# Altium schematic sheet FPGA.schdoc
size 240 x 209 mm
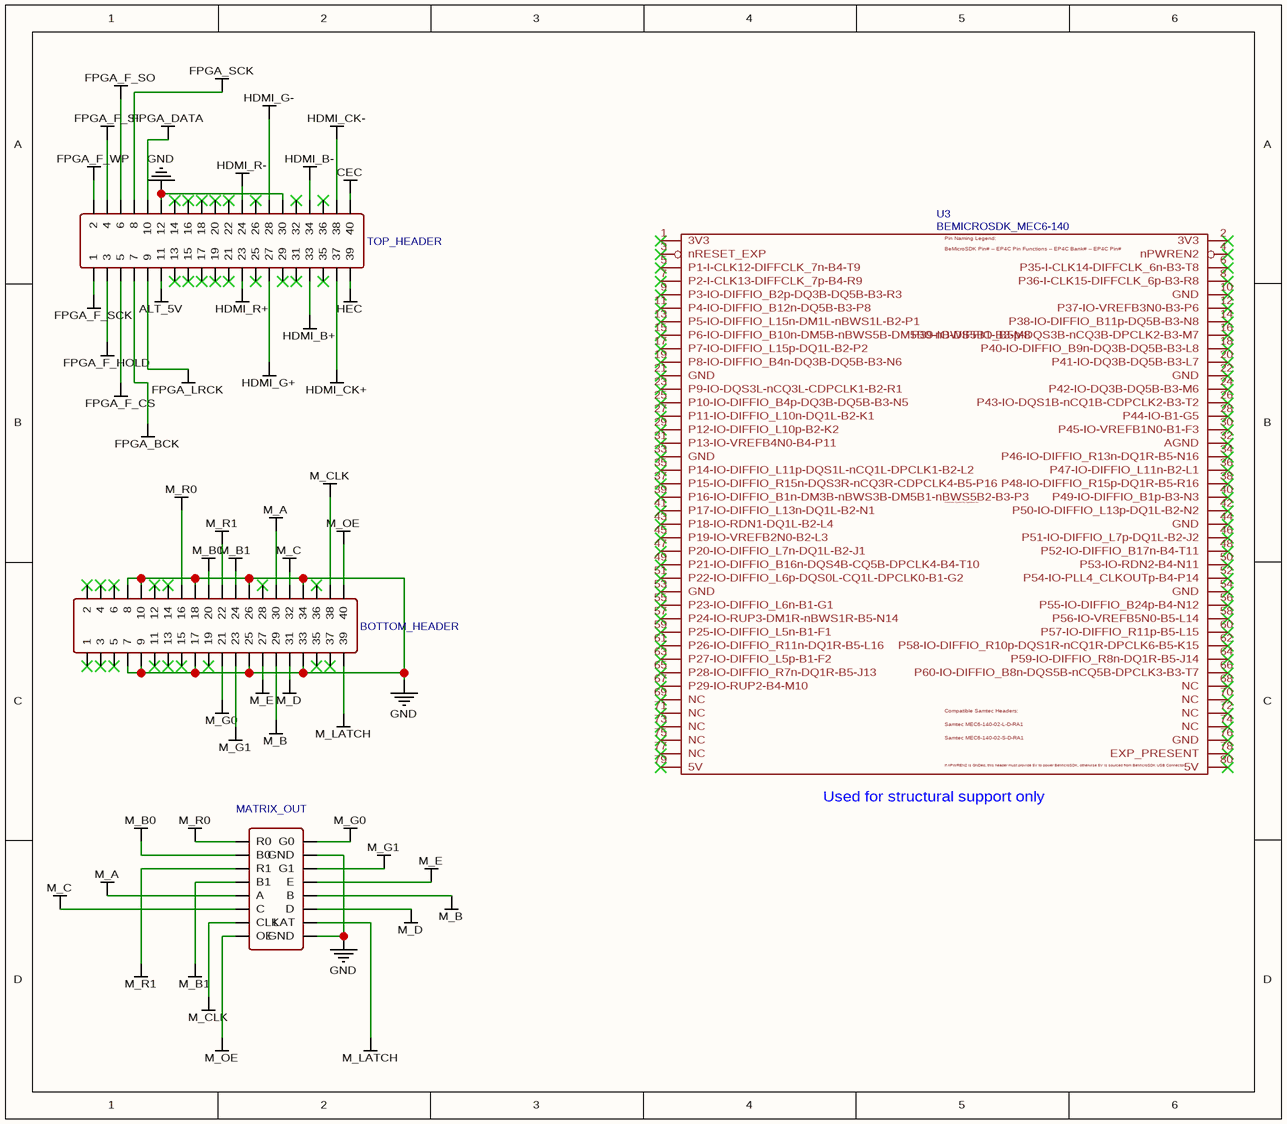
[diagram p0: FPGA.schdoc]

## Parts
BOTTOM_HEADER  Header-Male-2.54_2x20  [HDR-20X2/2.54]  (value not drawn)
MATRIX_OUT  MATRIX_OUT  [HDR-8X2/2.54]  (value not drawn)
TOP_HEADER  Header-Mal0  [HDR-20X2/2.54]  (value not drawn)
U3  BEMICROSDK_MEC6-140  [MEC6-140]

## Nets
ALT_5V: TOP_HEADER.11
CEC: TOP_HEADER.40
FPGA_BCK: TOP_HEADER.7
FPGA_DATA: TOP_HEADER.10
FPGA_F_CS: TOP_HEADER.5
FPGA_F_HOLD: TOP_HEADER.3
FPGA_F_SCK: TOP_HEADER.1
FPGA_F_SI: TOP_HEADER.4
FPGA_F_SO: TOP_HEADER.6
FPGA_F_WP: TOP_HEADER.2
FPGA_LRCK: TOP_HEADER.9
FPGA_SCK: TOP_HEADER.8
GND: BOTTOM_HEADER.7 BOTTOM_HEADER.8 BOTTOM_HEADER.9 BOTTOM_HEADER.10 BOTTOM_HEADER.17 BOTTOM_HEADER.18 BOTTOM_HEADER.25 BOTTOM_HEADER.26 BOTTOM_HEADER.33 BOTTOM_HEADER.34 MATRIX_OUT.4(GND) MATRIX_OUT.16(GND) TOP_HEADER.12 TOP_HEADER.30
HDMI_B+: TOP_HEADER.33
HDMI_B-: TOP_HEADER.34
HDMI_CK+: TOP_HEADER.37
HDMI_CK-: TOP_HEADER.38
HDMI_G+: TOP_HEADER.27
HDMI_G-: TOP_HEADER.28
HDMI_R+: TOP_HEADER.23
HDMI_R-: TOP_HEADER.24
HEC: TOP_HEADER.39
M_A: BOTTOM_HEADER.30 MATRIX_OUT.9(A)
M_B: BOTTOM_HEADER.29 MATRIX_OUT.10(B)
M_B0: BOTTOM_HEADER.20 MATRIX_OUT.3(B0)
M_B1: BOTTOM_HEADER.24 MATRIX_OUT.7(B1)
M_C: BOTTOM_HEADER.32 MATRIX_OUT.11(C)
M_CLK: BOTTOM_HEADER.38 MATRIX_OUT.13(CLK)
M_D: BOTTOM_HEADER.31 MATRIX_OUT.12(D)
M_E: BOTTOM_HEADER.27 MATRIX_OUT.8(E)
M_G0: BOTTOM_HEADER.21 MATRIX_OUT.2(G0)
M_G1: BOTTOM_HEADER.23 MATRIX_OUT.6(G1)
M_LATCH: BOTTOM_HEADER.39 MATRIX_OUT.14(LAT)
M_OE: BOTTOM_HEADER.40 MATRIX_OUT.15(OE)
M_R0: BOTTOM_HEADER.16 MATRIX_OUT.1(R0)
M_R1: BOTTOM_HEADER.22 MATRIX_OUT.5(R1)

Not connected (* = marked no-connect by the designer): BOTTOM_HEADER 1* 2* 3* 4* 5* 6* 11* 12* 13* 14* 15* 19* 28* 35* 36* 37*; TOP_HEADER 13* 14* 15* 16* 17* 18* 19* 20* 21* 22* 25* 26* 29* 31* 32* 35* 36*; U3 1(3V3)* 2(3V3)* 3(nRESET_EXP)* 4(nPWREN2)* 5(P1-I-CLK12-DIFFCLK_7n-B4-T9)* 6(P35-I-CLK14-DIFFCLK_6n-B3-T8)* 7(P2-I-CLK13-DIFFCLK_7p-B4-R9)* 8(P36-I-CLK15-DIFFCLK_6p-B3-R8)* 9(P3-IO-DIFFIO_B2p-DQ3B-DQ5B-B3-R3)* 10(GND)* 11(P4-IO-DIFFIO_B12n-DQ5B-B3-P8)* 12(P37-IO-VREFB3N0-B3-P6)* 13(P5-IO-DIFFIO_L15n-DM1L-nBWS1L-B2-P1)* 14(P38-IO-DIFFIO_B11p-DQ5B-B3-N8)* 15(P6-IO-DIFFIO_B10n-DM5B-nBWS5B-DM5B0-nBWS5B1-B3-M8)* 16(P39-IO-DIFFIO_B5p-DQS3B-nCQ3B-DPCLK2-B3-M7)* 17(P7-IO-DIFFIO_L15p-DQ1L-B2-P2)* 18(P40-IO-DIFFIO_B9n-DQ3B-DQ5B-B3-L8)* 19(P8-IO-DIFFIO_B4n-DQ3B-DQ5B-B3-N6)* 20(P41-IO-DQ3B-DQ5B-B3-L7)* 21(GND)* 22(GND)* 23(P9-IO-DQS3L-nCQ3L-CDPCLK1-B2-R1)* 24(P42-IO-DQ3B-DQ5B-B3-M6)* 25(P10-IO-DIFFIO_B4p-DQ3B-DQ5B-B3-N5)* 26(P43-IO-DQS1B-nCQ1B-CDPCLK2-B3-T2)* 27(P11-IO-DIFFIO_L10n-DQ1L-B2-K1)* 28(P44-IO-B1-G5)* 29(P12-IO-DIFFIO_L10p-B2-K2)* 30(P45-IO-VREFB1N0-B1-F3)* 31(P13-IO-VREFB4N0-B4-P11)* 32(AGND)* 33(GND)* 34(P46-IO-DIFFIO_R13n-DQ1R-B5-N16)* 35(P14-IO-DIFFIO_L11p-DQS1L-nCQ1L-DPCLK1-B2-L2)* 36(P47-IO-DIFFIO_L11n-B2-L1)* 37(P15-IO-DIFFIO_R15n-DQS3R-nCQ3R-CDPCLK4-B5-P16)* 38(P48-IO-DIFFIO_R15p-DQ1R-B5-R16)* 39(P16-IO-DIFFIO_B1n-DM3B-nBWS3B-DM5B1-nBWS5B2-B3-P3)* 40(P49-IO-DIFFIO_B1p-B3-N3)* 41(P17-IO-DIFFIO_L13n-DQ1L-B2-N1)* 42(P50-IO-DIFFIO_L13p-DQ1L-B2-N2)* 43(P18-IO-RDN1-DQ1L-B2-L4)* 44(GND)* 45(P19-IO-VREFB2N0-B2-L3)* 46(P51-IO-DIFFIO_L7p-DQ1L-B2-J2)* 47(P20-IO-DIFFIO_L7n-DQ1L-B2-J1)* 48(P52-IO-DIFFIO_B17n-B4-T11)* 49(P21-IO-DIFFIO_B16n-DQS4B-CQ5B-DPCLK4-B4-T10)* 50(P53-IO-RDN2-B4-N11)* 51(P22-IO-DIFFIO_L6p-DQS0L-CQ1L-DPCLK0-B1-G2)* 52(P54-IO-PLL4_CLKOUTp-B4-P14)* 53(GND)* 54(GND)* 55(P23-IO-DIFFIO_L6n-B1-G1)* 56(P55-IO-DIFFIO_B24p-B4-N12)* 57(P24-IO-RUP3-DM1R-nBWS1R-B5-N14)* 58(P56-IO-VREFB5N0-B5-L14)* 59(P25-IO-DIFFIO_L5n-B1-F1)* 60(P57-IO-DIFFIO_R11p-B5-L15)* 61(P26-IO-DIFFIO_R11n-DQ1R-B5-L16)* 62(P58-IO-DIFFIO_R10p-DQS1R-nCQ1R-DPCLK6-B5-K15)* 63(P27-IO-DIFFIO_L5p-B1-F2)* 64(P59-IO-DIFFIO_R8n-DQ1R-B5-J14)* 65(P28-IO-DIFFIO_R7n-DQ1R-B5-J13)* 66(P60-IO-DIFFIO_B8n-DQS5B-nCQ5B-DPCLK3-B3-T7)* 67(P29-IO-RUP2-B4-M10)* 68(NC)* 69(NC)* 70(NC)* 71(NC)* 72(NC)* 73(NC)* 74(NC)* 75(NC)* 76(GND)* 77(NC)* 78(EXP_PRESENT)* 79(5V)* 80(5V)*

## Notes on the sheet
- (near U3) Used for structural support only
- (in symbol BEMICROSDK_MEC6-140) Pin Naming Legend:; BeMicroSDK Pin# -- EP4C Pin Functions -- EP4C Bank# -- EP4C Pin#; Schematic Symbol By Opendous Inc.; Compatible Samtec Headers:; Samtec MEC6-140-02-L-D-RA1; Samtec MEC6-140-02-S-D-RA1; If nPWREN2 is GNDed, this header must provide 5V to power BeMicroSDK, otherwise 5V is sourced from BeMicroSDK USB Connector

## Library data of the parts
BOTTOM_HEADER = Header-Male-2.54_2x20: BOM_Manufacturer: ReliaPro; BOM_Supplier: LCSC; BOM_Manufacturer Part: Header-Male-2.54_2x20; image: http://image.lceda.cn/szlcsc/C50980.jpg; BOM_Supplier Part: C50980; spicePre: P
MATRIX_OUT = MATRIX_OUT: BOM_Manufacturer: BOOMELE; BOM_Manufacturer Part: Double row straight 2*8Headers  Pins 2.54mm; BOM_Supplier: LCSC; image: //image.lceda.cn/szlcsc/C68234.jpg; BOM_Supplier Part: C68234; spicePre: P
TOP_HEADER = Header-Mal0: BOM_Manufacturer: ReliaPro; BOM_Manufacturer Part: Header-Male-2.54_2x20; BOM_Supplier: LCSC; image: http://image.lceda.cn/szlcsc/C50980.jpg; BOM_Supplier Part: C50980; spicePre: P
U3 = BEMICROSDK_MEC6-140: Package Display: No; timeStamp: 1470781096; BOM_Manufacturer Part: ?; spicePre: U